# Altium schematic sheet Sheet1.SchDoc
size A; SheetNumber: 1; SheetTotal: 1
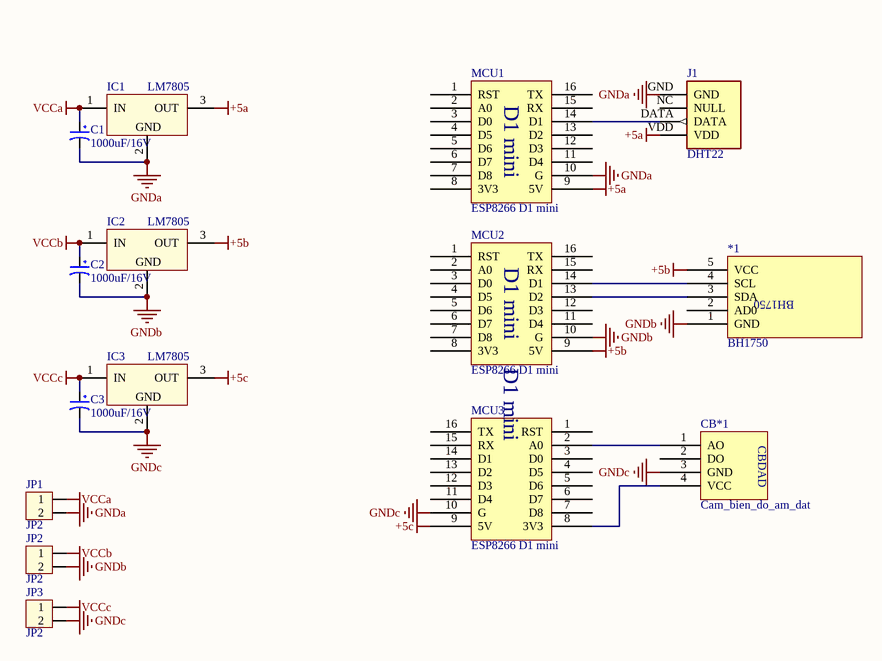
[diagram p0: Sheet1.SchDoc]

## Parts
*1  BH1750  [BH1750]
C1  1000uF/16V  [CP1.5/3.4]
C2  1000uF/16V  [CP1.5/3.4]
C3  1000uF/16V  [CP1.5/3.4]
CB*1  Cam_bien_do_am_dat  [Am dat]
IC1  LM7805  [QTO-220]
IC2  LM7805  [QTO-220]
IC3  LM7805  [QTO-220]
J1  DHT22  [DHT22]
JP1  JP2  [CON2]
JP2  JP2  [CON2]
JP3  JP2  [CON2]
MCU1  ESP8266 D1 mini  [ESP D1 mini]
MCU2  ESP8266 D1 mini  [ESP D1 mini]
MCU3  ESP8266 D1 mini  [ESP D1 mini]

## Nets
+5a: IC1.3(OUT) J1.VDD MCU1.9(5V)
+5b: *1.5(VCC) IC2.3(OUT) MCU2.9(5V)
+5c: IC3.3(OUT) MCU3.9(5V)
GNDa: C1.2 IC1.2(GND) J1.GND JP1.2 MCU1.10(G)
GNDb: *1.1(GND) C2.2 IC2.2(GND) JP2.2 MCU2.10(G)
GNDc: C3.2 CB*1.3(GND) IC3.2(GND) JP3.2 MCU3.10(G)
VCCa: C1.1 IC1.1(IN) JP1.1
VCCb: C2.1 IC2.1(IN) JP2.1
VCCc: C3.1 IC3.1(IN) JP3.1
Net*1_3: *1.3(SDA) MCU2.13(D2)
Net*1_4: *1.4(SCL) MCU2.14(D1)
NetCB*1_1: CB*1.1(AO) MCU3.2(A0)
NetCB*1_4: CB*1.4(VCC) MCU3.8(3V3)
NetJ1_DATA: J1.DATA MCU1.14(D1)

Not connected (* = marked no-connect by the designer): *1 2(AD0); CB*1 2(DO); J1 NC(NULL); MCU1 1(RST) 2(A0) 3(D0) 4(D5) 5(D6) 6(D7) 7(D8) 8(3V3) 11(D4) 12(D3) 13(D2) 15(RX) 16(TX); MCU2 1(RST) 2(A0) 3(D0) 4(D5) 5(D6) 6(D7) 7(D8) 8(3V3) 11(D4) 12(D3) 15(RX) 16(TX); MCU3 1(RST) 3(D0) 4(D5) 5(D6) 6(D7) 7(D8) 11(D4) 12(D3) 13(D2) 14(D1) 15(RX) 16(TX)

## Notes on the sheet
- (in symbol Cam_bien_do_am_dat) CBDAD
- (in symbol ESP8266 D1 mini) D1 mini

## Library data of the parts
C1-C3 = CP4: Cap 1000uF/16V - 220uF/50V; Description 5: 4,7uF>10uF/250V_3,3uF>10uF/400V - 2,2uF>4,7uF/450V; Description 1: 2200uF-3300uF/6,3V - 1000uF-2200uF/10V; Description 2: 1000uF/16V - 470uF => 1000uF/25V - 100uF/100V; Description 3: 330uF>470uF/35V_220uF>470uF/50V_10uF>22uF/250V; Description 4: 220uF => 330uF/63V - 10uF =>33uF/160 - 200V; Value: 1000uF/16V
IC1-IC3 = LM78xx: On ap +, from + 5 to + 24VDC; Value: LM7805
J1 = DHT22: Capacitive-type humidity and temperature module/sensor; MF: Aosong Electronics; SnapEDA_Link: https://www.snapeda.com/parts/DHT22/Aosong+Electronics/view-part/?ref=snap; Package: Package; Value: *; MP: DHT22; Check_prices: https://www.snapeda.com/parts/DHT22/Aosong+Electronics/view-part/?ref=eda
JP1-JP3 = Con2: Connector 2; Value: Connector 2